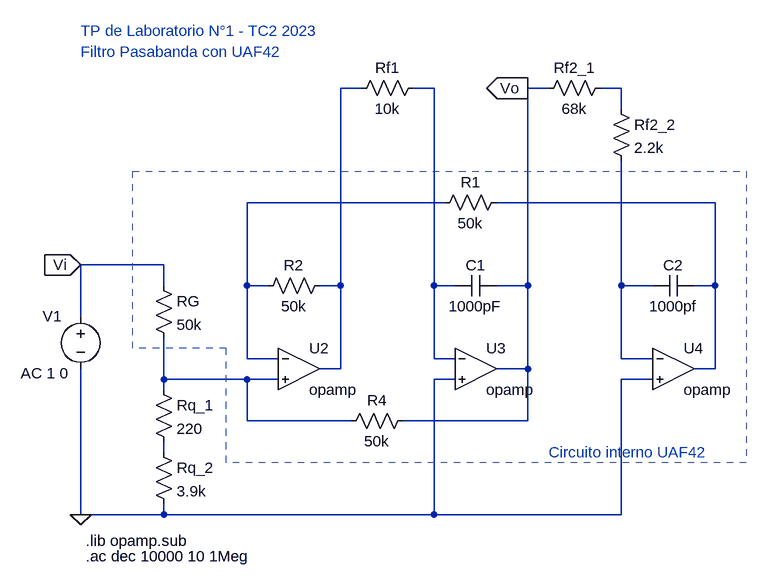
[diagram p0: schematic pasabanda_uaf42.asc]
pasabanda_uaf42.asc, the LTspice schematic file:
Version 4
SHEET 1 880 1312
WIRE -304 576 -336 576
WIRE -192 576 -224 576
WIRE -16 576 -48 576
WIRE 96 576 64 576
WIRE 96 608 96 576
WIRE -176 752 -480 752
WIRE 240 752 -96 752
WIRE -608 848 -736 848
WIRE -608 880 -608 848
WIRE -480 880 -480 752
WIRE -448 880 -480 880
WIRE -336 880 -336 576
WIRE -336 880 -368 880
WIRE -192 880 -192 576
WIRE -160 880 -192 880
WIRE -48 880 -48 576
WIRE -48 880 -96 880
WIRE 96 880 96 688
WIRE 144 880 96 880
WIRE 240 880 240 752
WIRE 240 880 208 880
WIRE -736 928 -736 848
WIRE -480 992 -480 880
WIRE -432 992 -480 992
WIRE -192 992 -192 880
WIRE -160 992 -192 992
WIRE 96 992 96 880
WIRE 144 992 96 992
WIRE -336 1008 -336 880
WIRE -336 1008 -368 1008
WIRE -48 1008 -48 880
WIRE -48 1008 -96 1008
WIRE 240 1008 240 880
WIRE 240 1008 208 1008
WIRE -608 1024 -608 960
WIRE -480 1024 -608 1024
WIRE -432 1024 -480 1024
WIRE -160 1024 -192 1024
WIRE 144 1024 96 1024
WIRE -608 1040 -608 1024
WIRE -480 1088 -480 1024
WIRE -320 1088 -480 1088
WIRE -48 1088 -48 1008
WIRE -48 1088 -240 1088
WIRE -608 1136 -608 1120
WIRE -736 1232 -736 1008
WIRE -608 1232 -608 1216
WIRE -608 1232 -736 1232
WIRE -192 1232 -192 1024
WIRE -192 1232 -608 1232
WIRE 96 1232 96 1024
WIRE 96 1232 -192 1232
FLAG -736 1232 0
FLAG -48 576 Vo
IOPIN -48 576 Out
FLAG -736 848 Vi
IOPIN -736 848 In
SYMBOL OpAmps\\opamp -400 944 R0
SYMATTR InstName U2
SYMBOL OpAmps\\opamp -128 944 R0
SYMATTR InstName U3
SYMBOL OpAmps\\opamp 176 944 R0
SYMATTR InstName U4
SYMBOL res -624 864 R0
SYMATTR InstName RG
SYMATTR Value 50k
SYMBOL res -224 1072 R90
WINDOW 0 0 56 VBottom 2
WINDOW 3 32 56 VTop 2
SYMATTR InstName R4
SYMATTR Value 50k
SYMBOL res -352 864 R90
WINDOW 0 0 56 VBottom 2
WINDOW 3 32 56 VTop 2
SYMATTR InstName R2
SYMATTR Value 50k
SYMBOL res -80 736 R90
WINDOW 0 0 56 VBottom 2
WINDOW 3 32 56 VTop 2
SYMATTR InstName R1
SYMATTR Value 50k
SYMBOL cap -96 864 R90
WINDOW 0 0 32 VBottom 2
WINDOW 3 32 32 VTop 2
SYMATTR InstName C1
SYMATTR Value 1000pF
SYMBOL cap 208 864 R90
WINDOW 0 0 32 VBottom 2
WINDOW 3 32 32 VTop 2
SYMATTR InstName C2
SYMATTR Value 1000pf
SYMBOL res -208 560 R90
WINDOW 0 0 56 VBottom 2
WINDOW 3 32 56 VTop 2
SYMATTR InstName Rf1
SYMATTR Value 10k
SYMBOL res 80 560 R90
WINDOW 0 0 56 VBottom 2
WINDOW 3 32 56 VTop 2
SYMATTR InstName Rf2_1
SYMATTR Value 68k
SYMBOL voltage -736 912 R0
WINDOW 123 -92 103 Left 2
WINDOW 39 0 0 Left 0
WINDOW 0 -58 15 Left 2
SYMATTR Value2 AC 1 0
SYMATTR InstName V1
SYMATTR Value ""
SYMBOL res -624 1024 R0
SYMATTR InstName Rq_1
SYMATTR Value 220
SYMBOL res -624 1120 R0
SYMATTR InstName Rq_2
SYMATTR Value 3.9k
SYMBOL res 80 592 R0
SYMATTR InstName Rf2_2
SYMATTR Value 2.2k
TEXT -728 1272 Left 2 !.lib opamp.sub
TEXT -728 1296 Left 2 !.ac dec 10000 10 1Meg
TEXT -16 1136 Left 2 ;Circuito interno UAF42
TEXT -736 520 Left 2 ;Filtro Pasabanda con UAF42
TEXT -736 488 Left 2 ;TP de Laboratorio N°1 - TC2 2023
LINE Normal -512 976 -656 976 2
LINE Normal -512 1152 -512 976 2
LINE Normal 288 1152 -512 1152 2
LINE Normal 288 704 288 1152 2
LINE Normal -656 704 288 704 2
LINE Normal -656 976 -656 704 2

The netlist it stands for:
* pasabanda_uaf42.asc
XU2 N004 N007 N001 opamp Aol=100K GBW=10Meg  ; pins invin noninvin out
XU3 N002 0 Vo opamp Aol=100K GBW=10Meg  ; pins invin noninvin out
XU4 N006 0 N005 opamp Aol=100K GBW=10Meg  ; pins invin noninvin out
RG Vi N007 50k
R4 Vo N007 50k
R2 N001 N004 50k
R1 N005 N004 50k
C1 Vo N002 1000pF
C2 N005 N006 1000pf
Rf1 N002 N001 10k
Rf2_1 N003 Vo 68k
V1 Vi 0 AC 1 0
Rq_1 N007 N008 220
Rq_2 N008 0 3.9k
Rf2_2 N003 N006 2.2k
.lib opamp.sub
.ac dec 10000 10 1Meg
* Circuito interno UAF42
* Filtro Pasabanda con UAF42
* TP de Laboratorio N°1 - TC2 2023
.backanno
.end